# EAGLE design 5VAC-DCReg (EAGLE 9.6.2)
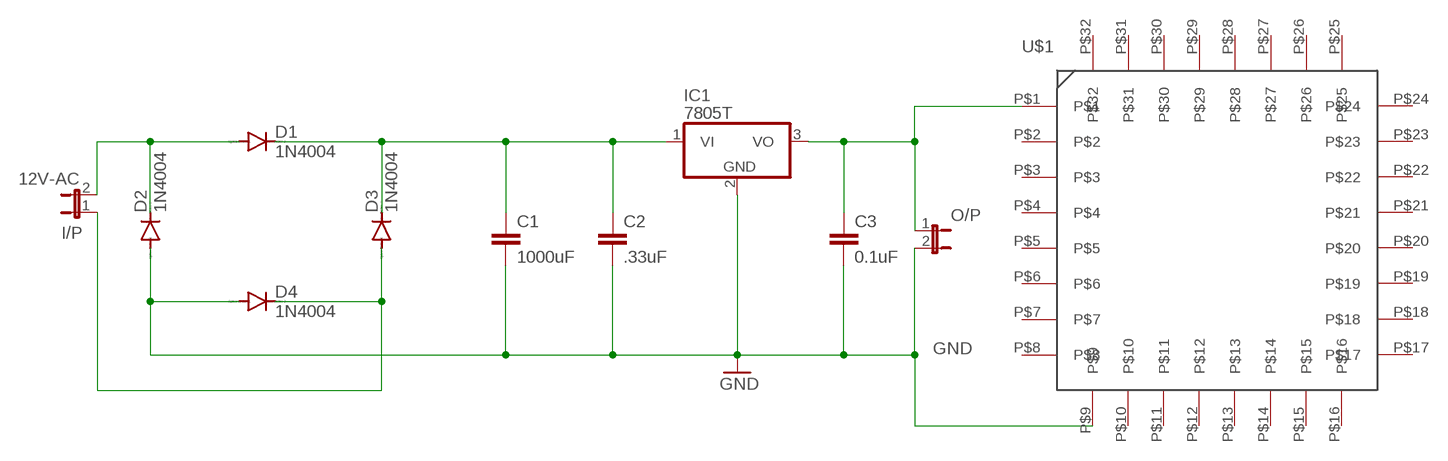
[diagram p0: schematic, sheet 1]

## Parts
C1  1000uF  C2,5-3  [C2.5-3]
C2  .33uF  C2,5-3  [C2.5-3]
C3  0.1uF  C2,5-3  [C2.5-3]
D1  1N4004  [DO41-10]
D2  1N4004  [DO41-10]
D3  1N4004  [DO41-10]
D4  1N4004  [DO41-10]
I/P  12V-AC  JP1E  [JP1]
IC1  7805T  [TO220H]
O/P  JP1E  [JP1]
U$1  MEGA8L-DEV  [TQFP-MEGA8L]

## Nets
GND: C1.2 C2.2 C3.2 D2.A D4.A IC1.2(GND) O/P.2 U$1.P$9
N$1: D1.A D2.C I/P.2
N$3: D3.A D4.C I/P.1
N$4: C1.1 C2.1 D1.C D3.C IC1.1(VI)
N$6: C3.1 IC1.3(VO) O/P.1 U$1.P$1
Unconnected: U$1.P$2 U$1.P$3 U$1.P$4 U$1.P$5 U$1.P$6 U$1.P$7 U$1.P$8 U$1.P$10 U$1.P$11 U$1.P$12 U$1.P$13 U$1.P$14 U$1.P$15 U$1.P$16 U$1.P$17 U$1.P$18 U$1.P$19 U$1.P$20 U$1.P$21 U$1.P$22 U$1.P$23 U$1.P$24 U$1.P$25 U$1.P$26 U$1.P$27 U$1.P$28 U$1.P$29 U$1.P$30 U$1.P$31 U$1.P$32

## Library data of the parts
C1-C3 = capacitor-wima:C: CAPACITOR naming: grid - package width
D1-D4 = diode:1N4004: DIODE general purpose rectifier, 1 A
I/P O/P = jumper:JP1E: JUMPER
IC1 = linear:78*: Positive VOLTAGE REGULATOR Source: http://cache.national.com/ds/LM/LM78L05.pdf http://www.fairchildsemi.com/ds/LM/LM7805.pdf
U$1 = NIK-MEGA8L:MEGA8L-DEV

## Board
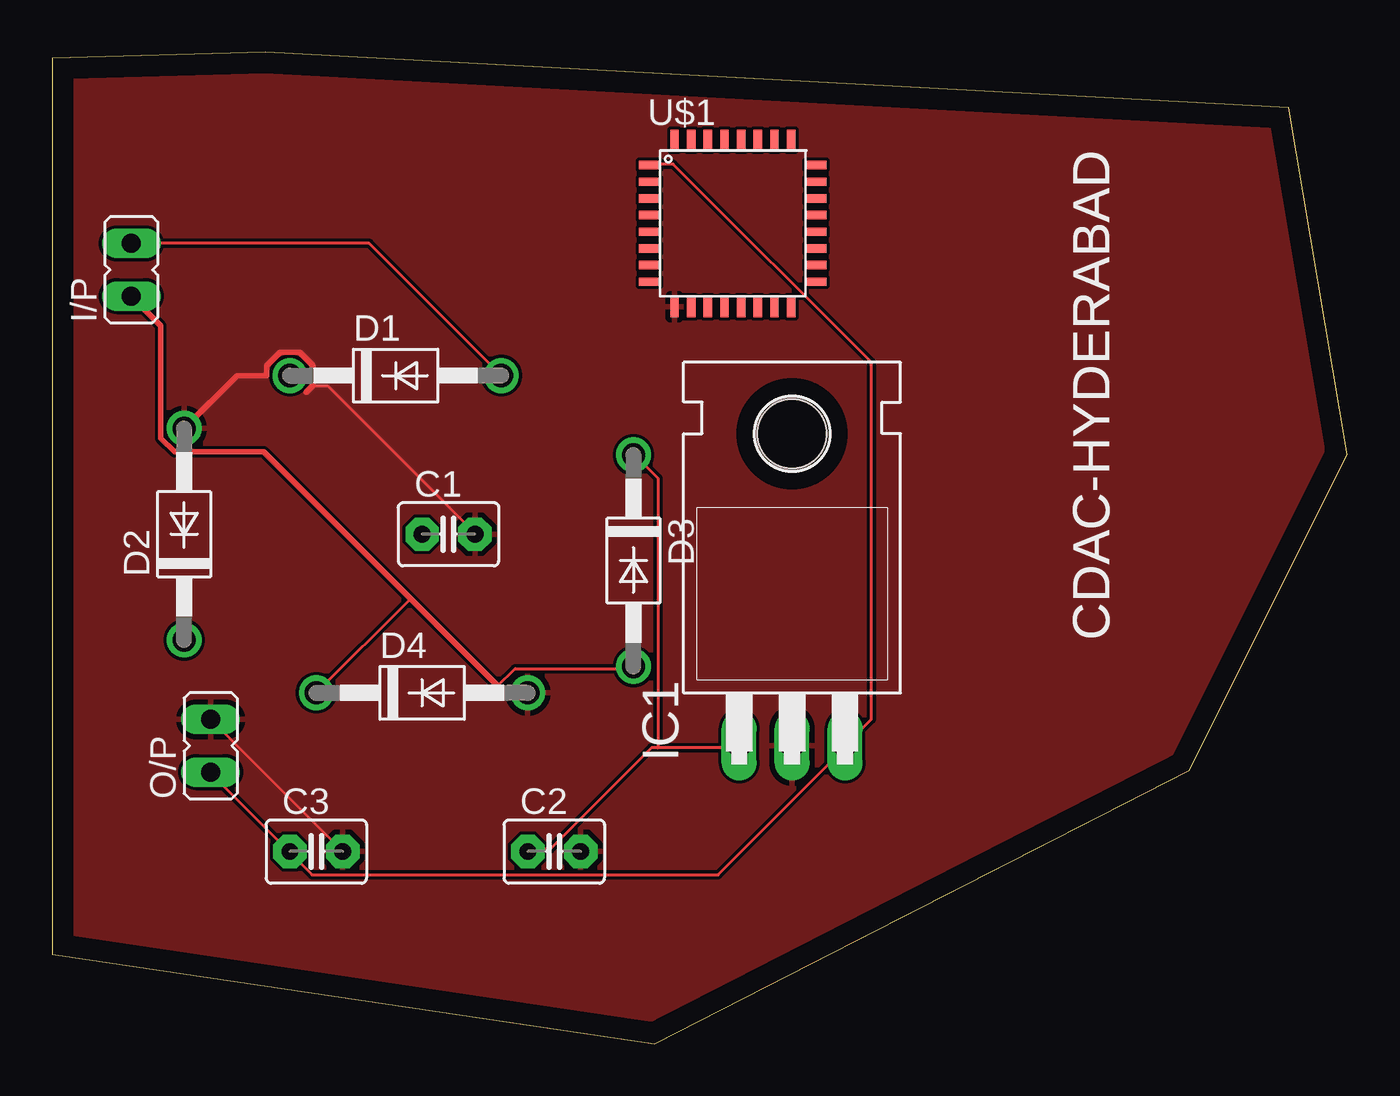
[diagram p1: board, top side]
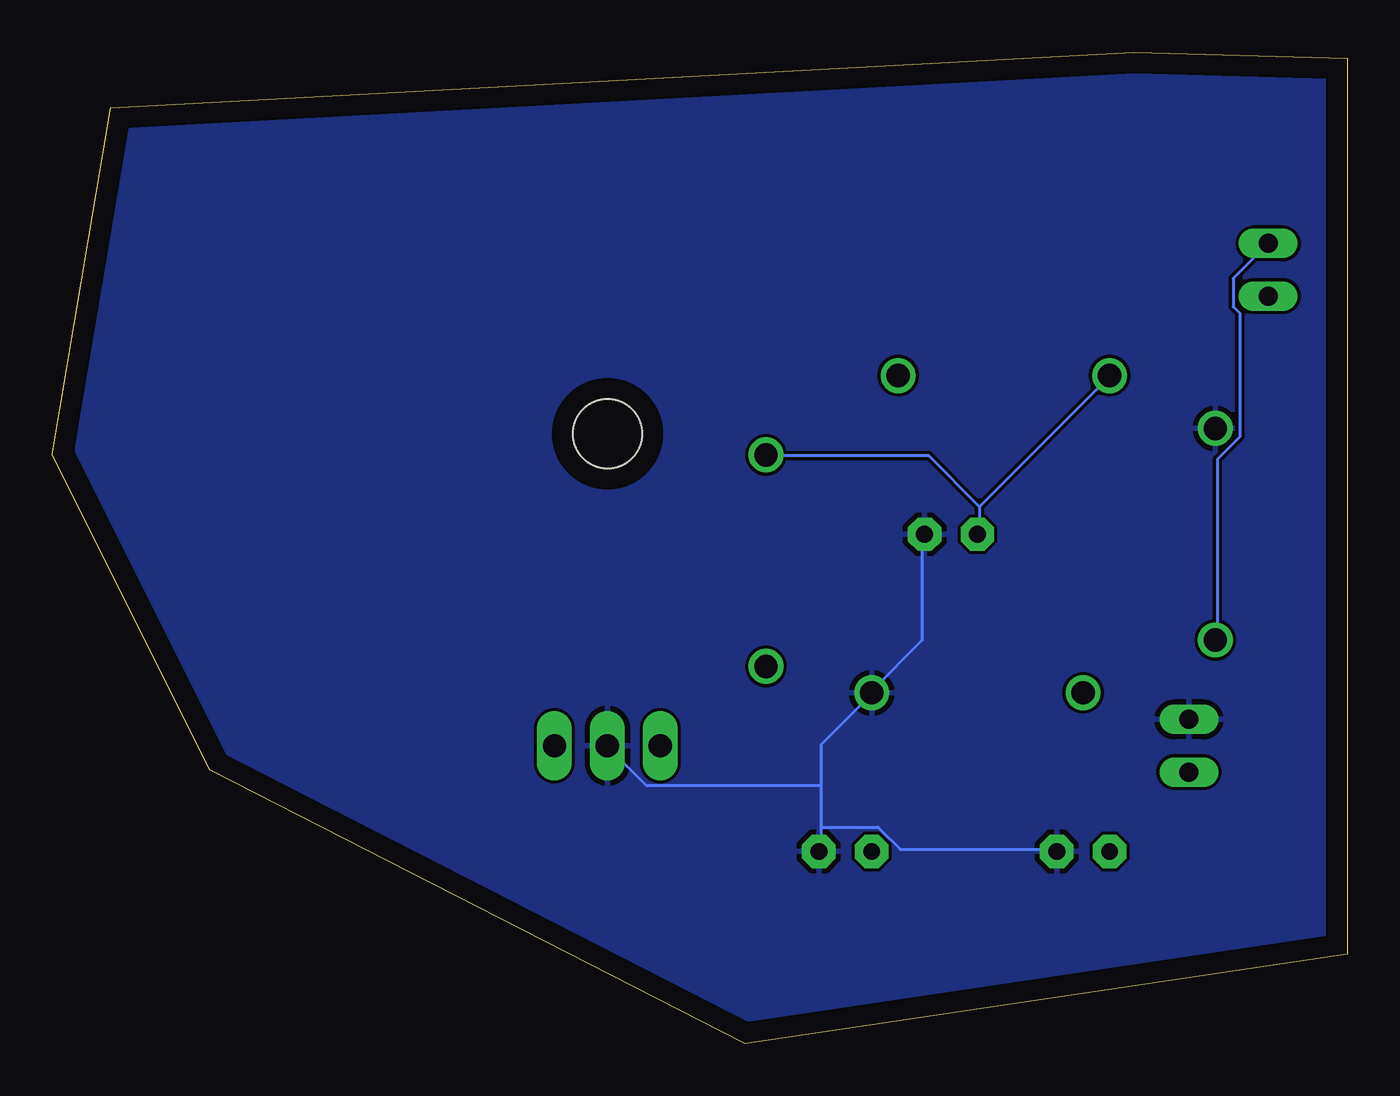
[diagram p2: board, bottom side, seen from below]

Size 62.25 x 47.63 mm. Coordinates in mm from the lower left corner, seen from the top.
Outline: 0,47.33 0,4.29 28.95,0 54.64,13.14 62.25,28.29 59.43,44.95 10.27,47.63 0,47.33
Outline: 0,47.33 0,47.33
Copper layers (1*16): Top 0.035mm / dielectric 1.5mm / Bottom 0.035mm
Design rules "default": minimum track width 6mil, minimum drill 0.35mm, track to track 6mil, track to pad 6mil, pad to pad 6mil, via to via 6mil, smd to smd 6mil, copper to edge 40mil, drill to drill 6mil, minimum pad ring 10mil, minimum via ring 8mil, stop-mask expansion 4mil, vias tented up to drill 0mil, thermal gap 10mil

### Footprints (pad centres in the part's own frame; a part is rotated, then mirrored left to right if it is on the bottom)
C2.5-3 = drill 0.813 pad 1.6 octagon: 1 -1.27,0; 2 1.27,0
DO41-10 = drill 1.118: A 5.08,0; C -5.08,0
JP1 = drill 0.914 long: 1 0,-1.27; 2 0,1.27
TO220H = drill 1.118 long: 1 -2.54,-10.16; 2 0,-10.16; 3 2.54,-10.16 | hole 3.302: 0,4.826
TQFP-MEGA8L = smd 1 x 0.4: P$1 -0.5,6.3; P$2 -0.5,5.5; P$3 -0.5,4.7; P$4 -0.5,3.9; P$5 -0.5,3.1; P$6 -0.5,2.3; P$7 -0.5,1.5; P$8 -0.5,0.7; P$17 7.5,0.7; P$18 7.5,1.5; P$19 7.5,2.3; P$20 7.5,3.1; P$21 7.5,3.9; P$22 7.5,4.7; P$23 7.5,5.5; P$24 7.5,6.3 | smd 0.4 x 1: P$9 0.7,-0.5; P$10 1.5,-0.5; P$11 2.3,-0.5; P$12 3.1,-0.5; P$13 3.9,-0.5; P$14 4.7,-0.5; P$15 5.5,-0.5; P$16 6.3,-0.5; P$25 6.3,7.5; P$26 5.5,7.5; P$27 4.7,7.5; P$28 3.9,7.5; P$29 3.1,7.5; P$30 2.3,7.5; P$31 1.5,7.5; P$32 0.7,7.5

### Placement (x,y rotation side)
C1  19.05,24.47 0 top
C2  24.13,9.23 0 top
C3  12.7,9.23 0 top
D1  16.51,32.09 0 top
D2  6.35,24.47 90 top
D3  27.94,23.2 270 top
D4  17.78,16.85 0 top
I/P  3.81,37.17 0 top
IC1  35.56,24.47 0 top
O/P  7.62,14.31 0 top
U$1  29.21,35.9 0 top

### Tracks (layer width: path | path; a pad name or v marks a point on that pad's centre or on a via)
GND
  Top 0.152: C3.2 O/P.2 | 12.55,31.63 12.65,31.58 13.26,31.58 20.27,24.57 C1.2
  Top 0.254: D2.A 8.89,32.09 10.31,32.09 10.31,32.55 10.97,33.21 11.89,33.21 12.55,32.55 12.55,32.24 12.7,32.09 12.55,31.94 12.55,31.63 12.22,31.3
  Bottom 0.152: 25.3,12.38 25.3,14.36 22.86,16.8 D4.A 22.86,16.95 20.42,19.39 20.42,24.42 C1.2 | 25.3,12.38 25.3,10.4 | 25.3,10.4 25.3,9.33 C2.2 | 25.3,12.38 33.68,12.38 35.51,14.21 IC1.2 | 25.3,10.4 22.55,10.4 21.49,9.33 14.02,9.33 C3.2
  pour Top: -1.27,49.87 66.04,49.87 66.04,-2.2 -1.27,-2.2
  pour Bottom: -2.54,52.41 68.58,52.41 68.58,-4.74 -3.81,-4.74 -3.81,52.41
N$1
  Top 0.152: I/P.2 15.24,38.44 D1.A
  Bottom 0.152: I/P.2 5.49,36.76 5.49,35.39 5.18,35.09 5.18,29.14 6.25,28.08 6.25,19.39 D2.C
N$3
  Top 0.152: 17.22,21.37 D4.C | 21.41,17.18 22.25,18.02 27.89,18.02 D3.A
  Top 0.254: I/P.1 5.23,34.48 5.23,29.09 5.89,28.43 10.16,28.43 17.22,21.37 21.41,17.18 21.74,16.85
N$4
  Top 0.152: 29.11,14.21 32.92,14.21 IC1.1 | 29.11,14.21 28.8,14.21 23.93,9.33 22.86,9.33 C2.1 | 29.11,14.21 29.11,27.16 28.04,28.23 D3.C
  Bottom 0.152: 17.68,25.79 17.68,24.57 C1.1 | 17.68,25.79 11.43,32.04 D1.C | 17.68,25.79 20.12,28.23 27.89,28.23 D3.C
N$6
  Top 0.152: 11.43,9.18 7.62,12.99 O/P.1 | 11.43,9.18 12.5,8.11 32,8.11 38.1,14.21 IC1.3 39.37,15.58 39.37,32.72 29.84,42.25 28.57,42.25 U$1.P$1 | 11.43,9.18 C3.1

### Text on the board
tPlace: CDAC-HYDERABAD | CDAC-HYDERABAD | CDAC-HYDERABAD